# EAGLE schematic ALUprudente (EAGLE 6.3)
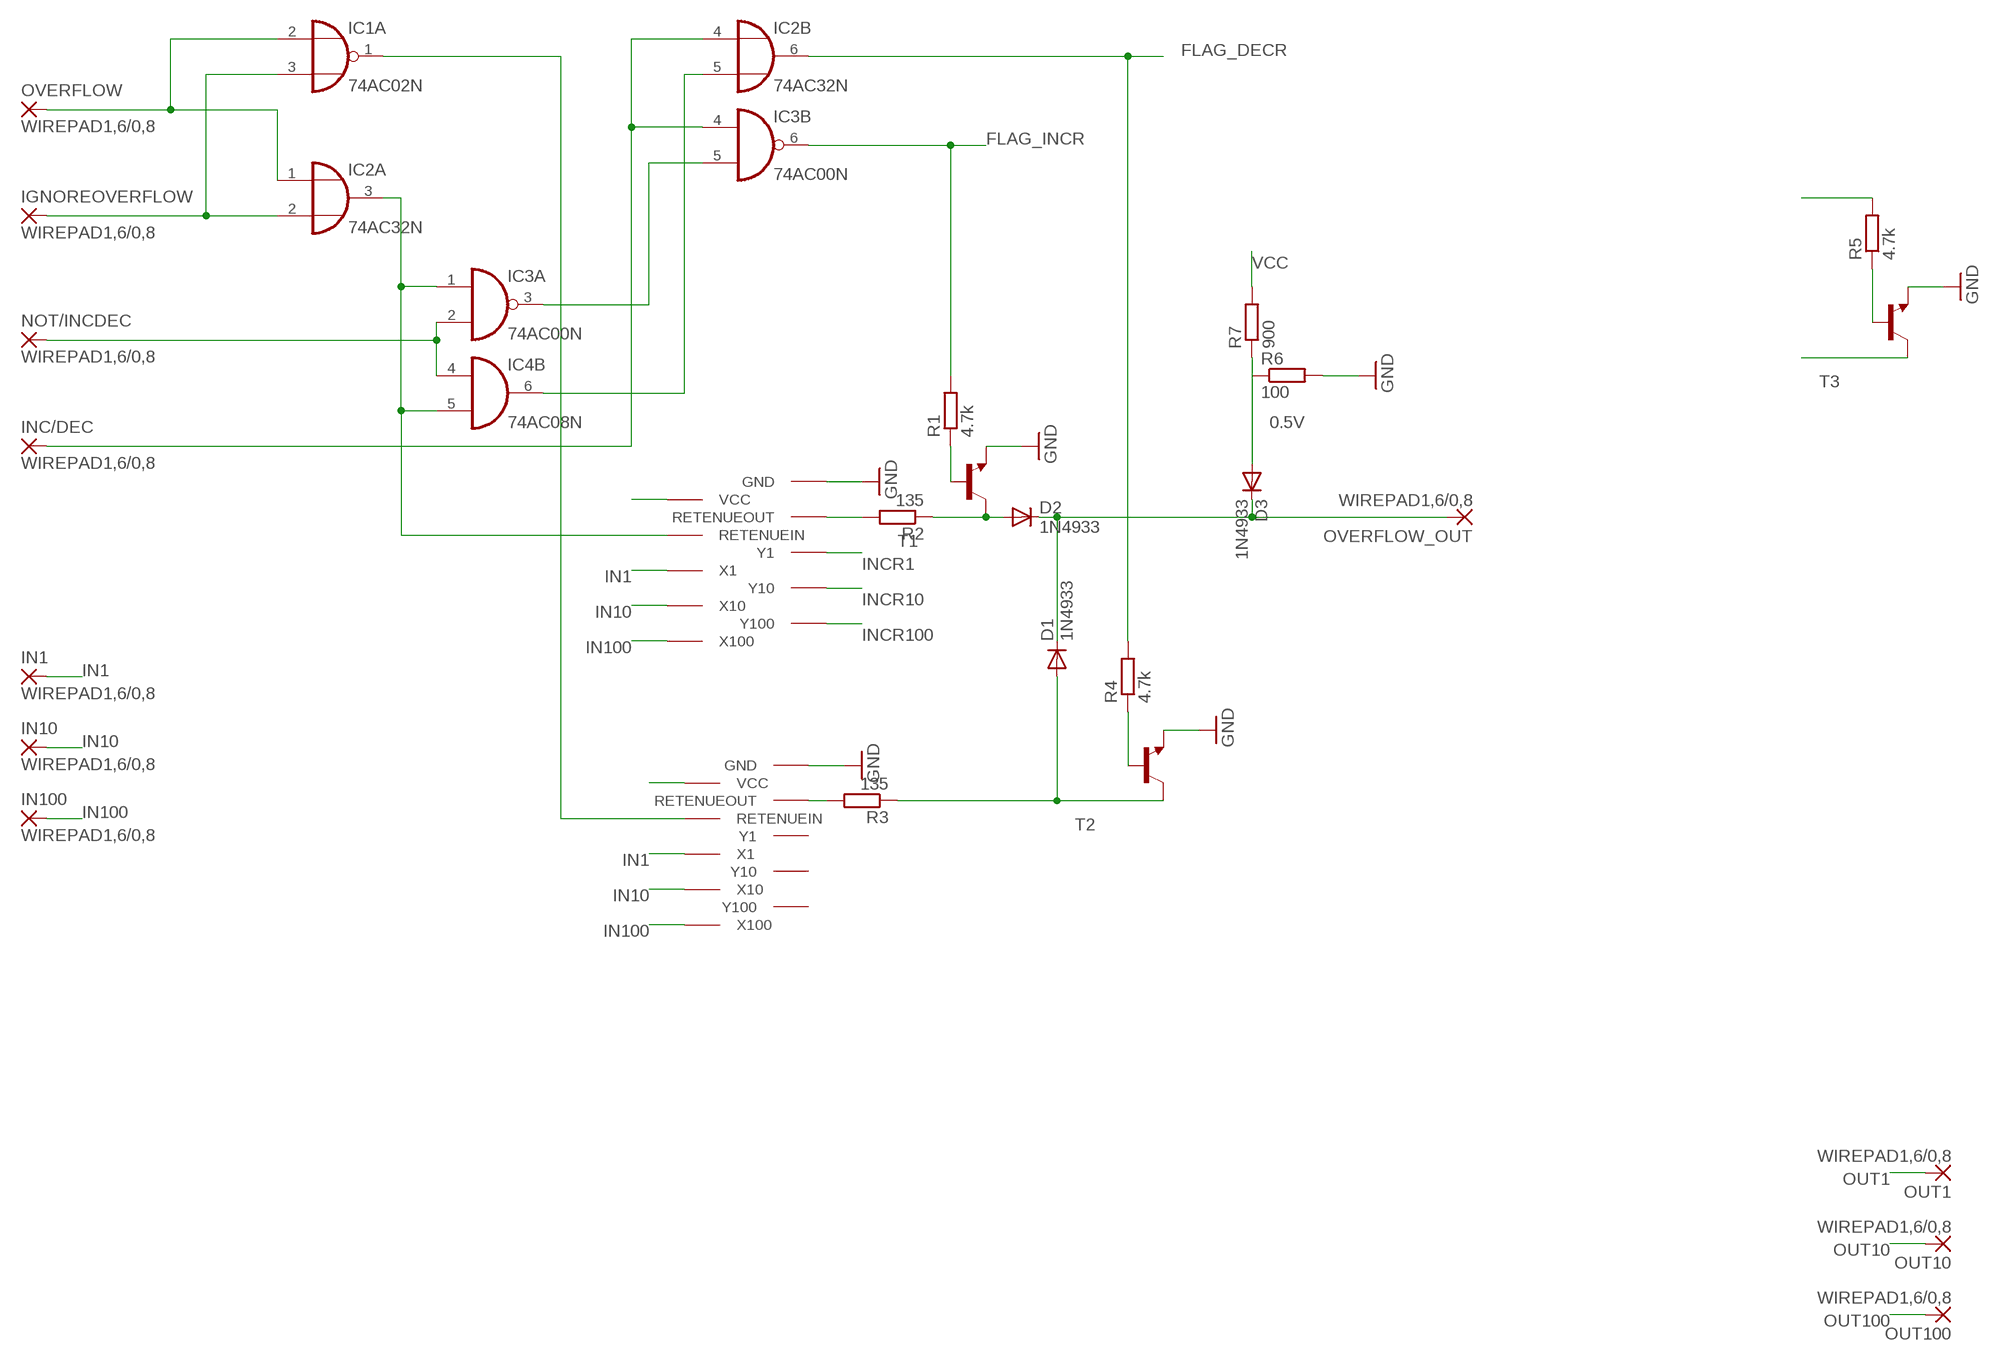
[diagram p0: schematic, sheet 1]

## Parts
D1  1N4933  [DO41-10]
D2  1N4933  [DO41-10]
D3  1N4933  [DO41-10]
IC1  74AC02N  [DIL14]
IC2  74AC32N  [DIL14]
IC3  74AC00N  [DIL14]
IC4  74AC08N  [DIL14]
IGNOREOVERFLOW  WIREPAD1,6/0,8  [1,6/0,8]
IN1  WIREPAD1,6/0,8  [1,6/0,8]
IN10  WIREPAD1,6/0,8  [1,6/0,8]
IN100  WIREPAD1,6/0,8  [1,6/0,8]
INC/DEC  WIREPAD1,6/0,8  [1,6/0,8]
NOT/INCDEC  WIREPAD1,6/0,8  [1,6/0,8]
OUT1  WIREPAD1,6/0,8  [1,6/0,8]
OUT10  WIREPAD1,6/0,8  [1,6/0,8]
OUT100  WIREPAD1,6/0,8  [1,6/0,8]
OVERFLOW  WIREPAD1,6/0,8  [1,6/0,8]
OVERFLOW_OUT  WIREPAD1,6/0,8  [1,6/0,8]
R1  4.7k  R-EU_0309/10  [0309/10]
R2  135  R-EU_0309/10  [0309/10]
R3  135  R-EU_0309/10  [0309/10]
R4  4.7k  R-EU_0309/10  [0309/10]
R5  4.7k  R-EU_0309/10  [0309/10]
R6  100  R-EU_0309/10  [0309/10]
R7  900  R-EU_0309/10  [0309/10]
T1  BC637-NPN-TO92-ECB  [TO92-ECB]
T2  BC637-NPN-TO92-ECB  [TO92-ECB]
T3  BC637-NPN-TO92-ECB  [TO92-ECB]
U$1  INCR3B  [INCR3B]
U$2  DECR3B  [DECR3B]

## Nets
0.5V: D3.A R7.1
FLAG_DECR: IC2.6(B:O) R4.2
FLAG_INCR: IC3.6(B:O) R1.2
GND: R6.2 T1.E T2.E T3.E U$1.GND U$2.GND
IN1: IN1.1(P) U$1.X1 U$2.X1
IN10: IN10.1(P) U$1.X10 U$2.X10
IN100: IN100.1(P) U$1.X100 U$2.X100
INCR1: U$1.Y1
INCR10: U$1.Y10
INCR100: U$1.Y100
N$1: IC1.2(A:I0) IC2.1(A:I0) OVERFLOW.1(P)
N$2: IC1.3(A:I1) IC2.2(A:I1) IGNOREOVERFLOW.1(P)
N$3: IC3.3(A:O) IC3.5(B:I1)
N$4: IC2.4(B:I0) IC3.4(B:I0) INC/DEC.1(P)
N$5: IC3.2(A:I1) IC4.4(B:I0) NOT/INCDEC.1(P)
N$6: IC2.3(A:O) IC3.1(A:I0) IC4.5(B:I1) U$1.RETENUEIN
N$7: IC2.5(B:I1) IC4.6(B:O)
N$8: IC1.1(A:O) U$2.RETENUEIN
N$9: R5.1 T3.B
N$10: R3.2 U$2.RETENUEOUT
N$11: R2.2 U$1.RETENUEOUT
N$12: D1.C D2.C D3.C OVERFLOW_OUT.1(P)
N$13: D1.A R3.1 T2.C
N$14: D2.A R2.1 T1.C
N$15: R1.1 T1.B
N$16: T3.C
N$17: R4.1 T2.B
N$18: R5.2
OUT1: OUT1.1(P)
OUT10: OUT10.1(P)
OUT100: OUT100.1(P)
VCC: R7.2 U$1.VCC U$2.VCC
Unconnected: IC1.4(B:O) IC1.5(B:I0) IC1.6(B:I1) IC1.8(C:I0) IC1.9(C:I1) IC1.10(C:O) IC1.11(D:I0) IC1.12(D:I1) IC1.13(D:O) IC2.8(C:O) IC2.9(C:I0) IC2.10(C:I1) IC2.11(D:O) IC2.12(D:I0) IC2.13(D:I1) IC3.8(C:O) IC3.9(C:I0) IC3.10(C:I1) IC3.11(D:O) IC3.12(D:I0) IC3.13(D:I1) IC4.1(A:I0) IC4.2(A:I1) IC4.3(A:O) IC4.8(C:O) IC4.9(C:I0) IC4.10(C:I1) IC4.11(D:O) IC4.12(D:I0) IC4.13(D:I1) R6.1 U$2.Y1 U$2.Y10 U$2.Y100

## Power pins joined to a net without a drawn wire
GND: IC1.7(P:GND) IC2.7(P:GND) IC3.7(P:GND) IC4.7(P:GND)
VCC: IC1.14(P:VCC) IC2.14(P:VCC) IC3.14(P:VCC) IC4.14(P:VCC)

## Library data of the parts
D1-D3 = diode:1N4933: DIODE fast recovery rectifier, 1A
IC1 = 74xx-eu:74*02: Quad 2-input NOR gate
IC2 = 74xx-eu:74*32: Quad 2-input OR gate
IC3 = 74xx-eu:74*00: Quad 2-input NAND gate
IC4 = 74xx-eu:74*08: Quad 2-input AND gate
IGNOREOVERFLOW IN1 IN10 IN100 INC/DEC NOT/INCDEC OUT1 OUT10 OUT100 OVERFLOW OVERFLOW_OUT = wirepad:WIREPAD: Wire PAD connect wire on PCB
R1-R7 = rcl:R-EU_: RESISTOR, European symbol
T1-T3 = transistor:*-NPN-: NPN Transistror BF959 corrected 2008.03.06
U$1 = incrementeur3b:INCR3B
U$2 = decrementeur3b:DECR3B